# Altium schematic sheet Elkapod_power_supply_controller_module.SchDoc
size A2; SheetNumber: 1; SheetTotal: 6
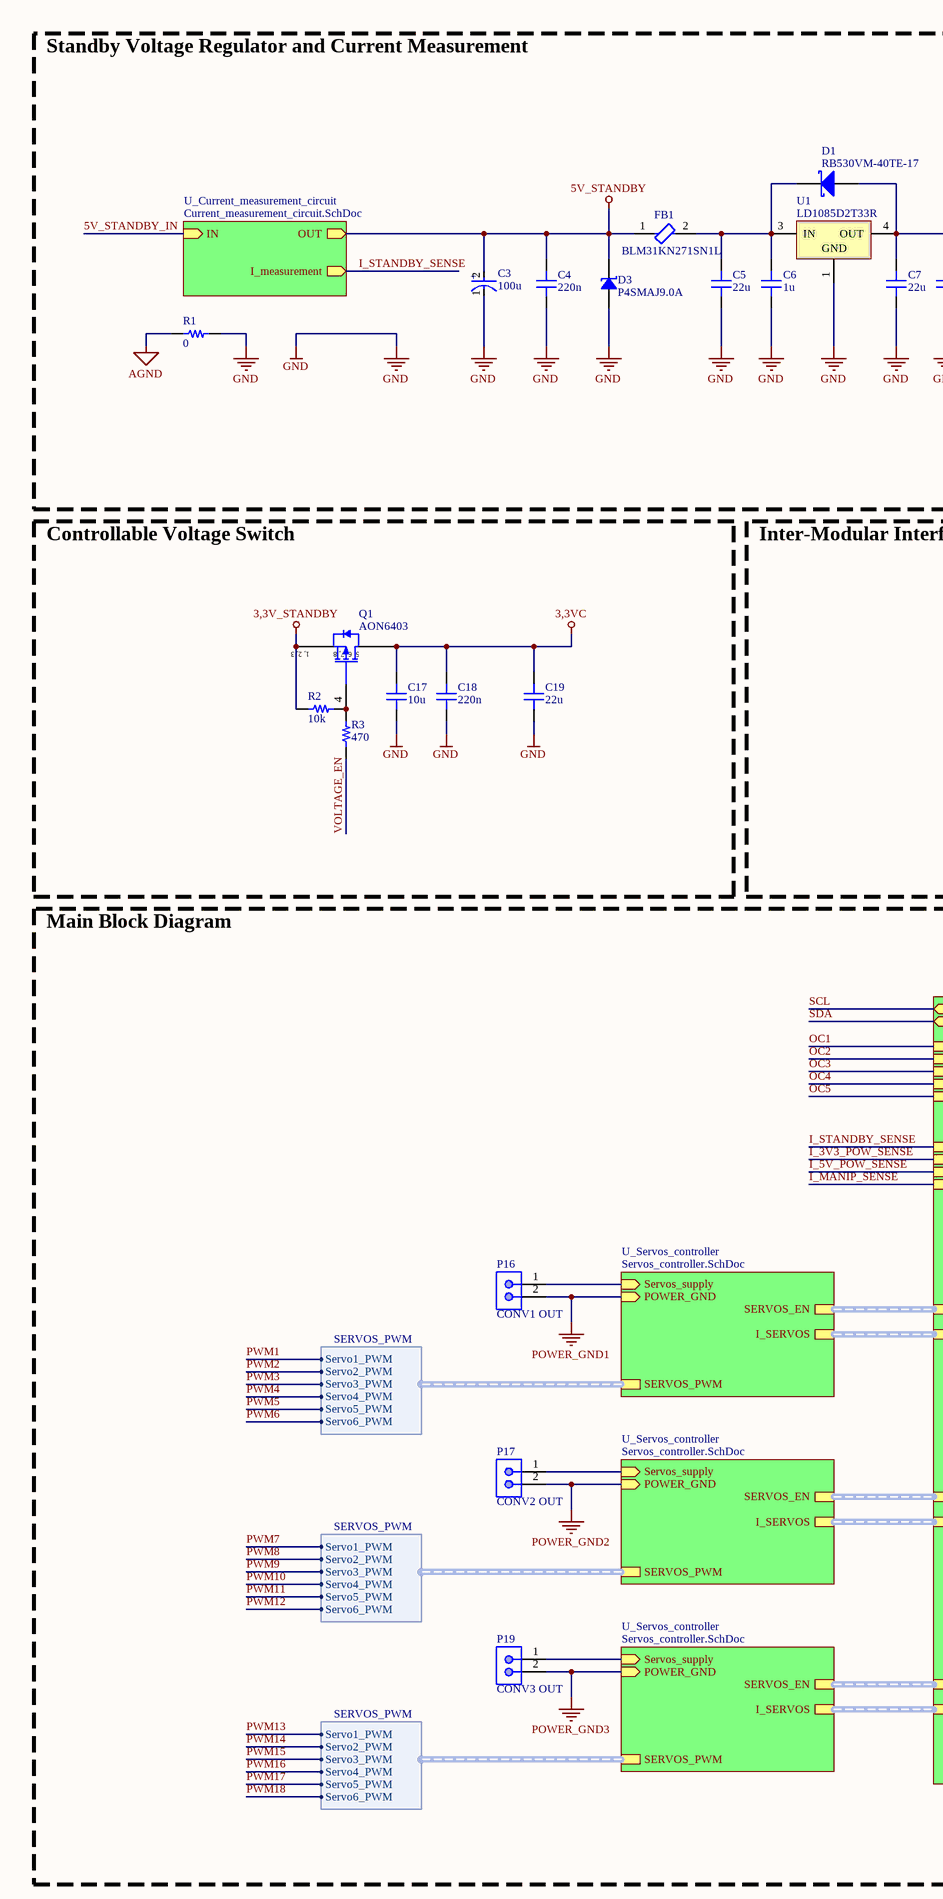
[diagram p0: Elkapod_power_supply_controller_module.SchDoc, left]
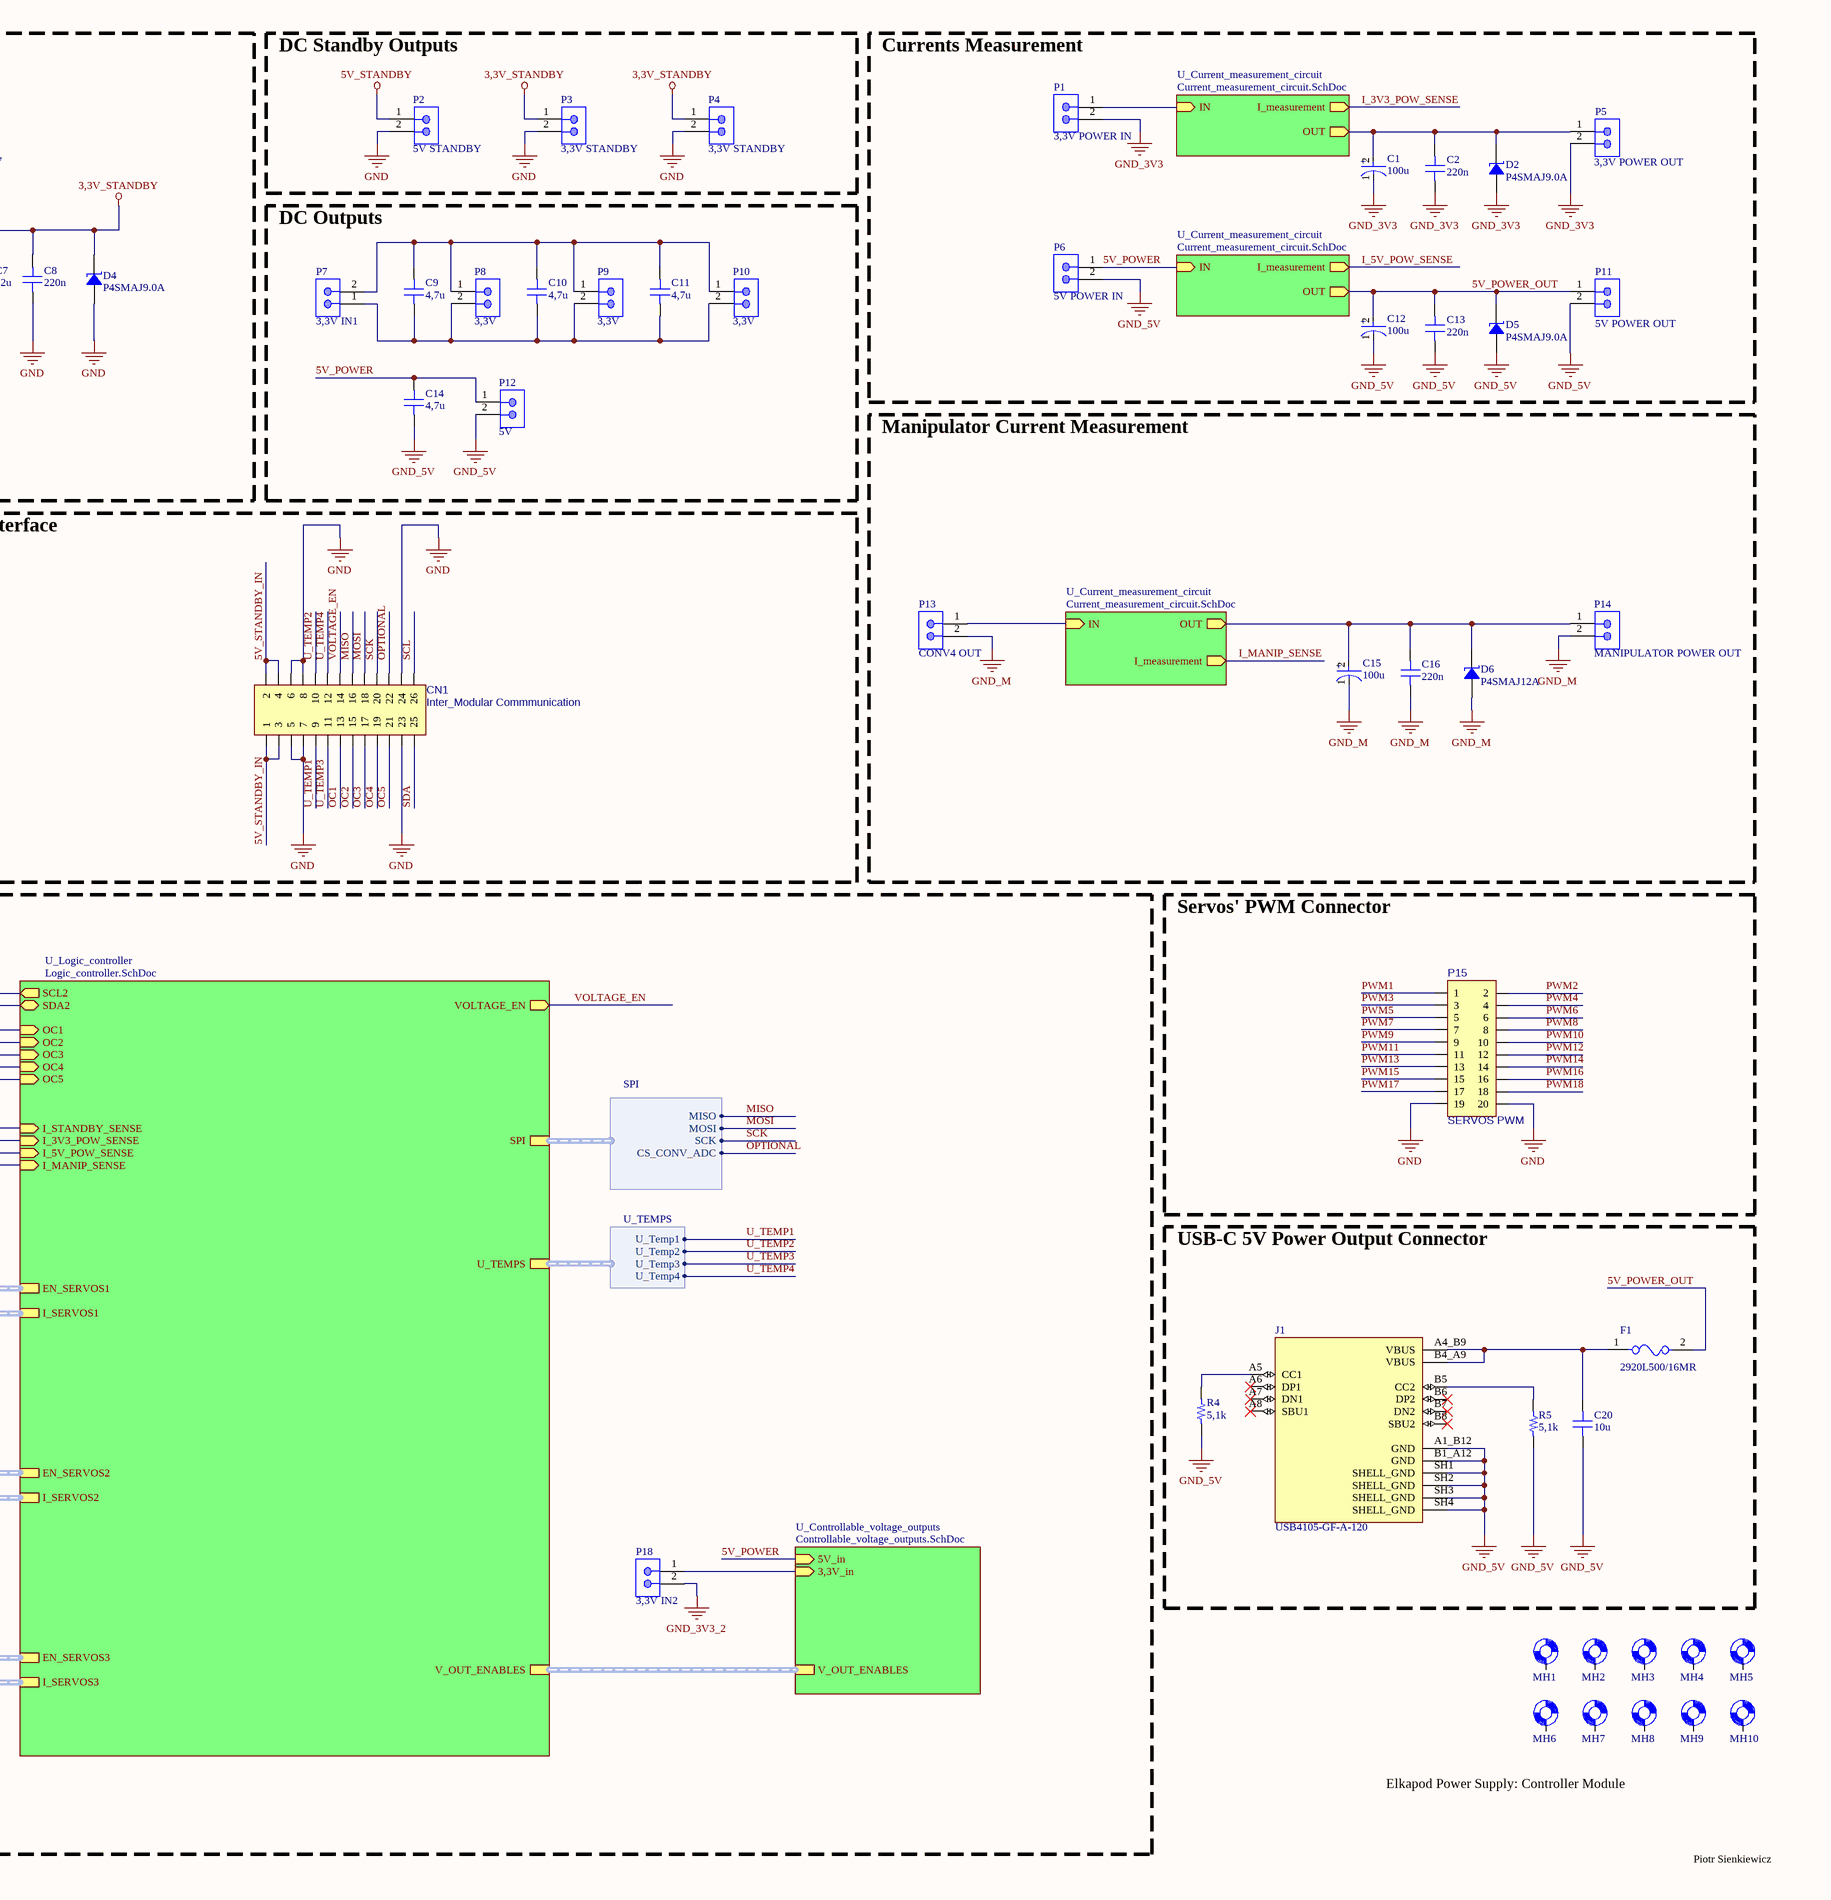
[diagram p1: Elkapod_power_supply_controller_module.SchDoc, right]

## Parts
C1  100u  [FP-FKE-MFG]
C2  220n  [CAP 0603_1608]
C3  100u  [FP-FKE-MFG]
C4  220n  [CAP 0603_1608]
C5  22u  [CAP 0805_2012]
C6  1u  [CAP 0603_1608]
C7  22u  [CAP 0805_2012]
C8  220n  [CAP 0603_1608]
C9  4,7u  [CAP 0603_1608]
C10  4,7u  [CAP 0603_1608]
C11  4,7u  [CAP 0603_1608]
C12  100u  [FP-FKE-MFG]
C13  220n  [CAP 0603_1608]
C14  4,7u  [CAP 0603_1608]
C15  100u  [FP-FKE-MFG]
C16  220n  [CAP 0603_1608]
C17  10u  [CAP 0603_1608]
C18  220n  [CAP 0603_1608]
C19  22u  [CAP 0805_2012]
C20  10u  [CAP 0603_1608]
CN1  Inter_Modular Commmunication  [GP_13x2]
D1  RB530VM-40TE-17  [SOD-323]
D2  P4SMAJ9.0A  [DO214AC SMA]
D3  P4SMAJ9.0A  [DO214AC SMA]
D4  P4SMAJ9.0A  [DO214AC SMA]
D5  P4SMAJ9.0A  [DO214AC SMA]
D6  P4SMAJ12A  [DO214AC SMA]
F1  2920L500/16MR  [FP-2920L-MFG]
FB1  BLM31KN271SN1L  [FP-BLM31-0_2-t1_6-d3_3-MFG]
J1  USB4105-GF-A-120  [USB4105-GF-A-120]
MH1  M3 Mounting Hole  [M3_MOUNTING_HOLE]  (value not drawn)
MH2  M3 Mounting Hole  [M3_MOUNTING_HOLE]  (value not drawn)
MH3  M3 Mounting Hole  [M3_MOUNTING_HOLE]  (value not drawn)
MH4  M3 Mounting Hole  [M3_MOUNTING_HOLE]  (value not drawn)
MH5  M3 Mounting Hole  [M3_MOUNTING_HOLE]  (value not drawn)
MH6  M3 Mounting Hole  [M3_MOUNTING_HOLE]  (value not drawn)
MH7  M3 Mounting Hole  [M3_MOUNTING_HOLE]  (value not drawn)
MH8  M3 Mounting Hole  [M3_MOUNTING_HOLE]  (value not drawn)
MH9  M3 Mounting Hole  [M3_MOUNTING_HOLE]  (value not drawn)
MH10  M3 Mounting Hole  [M3_MOUNTING_HOLE]  (value not drawn)
P1  3,3V POWER IN  [2x2,5mm2_WIRE]
P2  5V STANDBY  [MOLX-22-23-2021_V]
P3  3,3V STANDBY  [MOLX-22-23-2021_V]
P4  3,3V STANDBY  [MOLX-22-23-2021_V]
P5  3,3V POWER OUT  [XT60PW-M]
P6  5V POWER IN  [2x2,5mm2_WIRE]
P7  3,3V IN1  [2x2,5mm2_WIRE]
P8  3,3V  [MOLX-22-23-2021_V]
P9  3,3V  [MOLX-22-23-2021_V]
P10  3,3V  [MOLX-22-23-2021_V]
P11  5V POWER OUT  [XT60PW-M]
P12  5V  [MOLX-22-23-2021_V]
P13  CONV4 OUT  [2x2,5mm2_WIRE]
P14  MANIPULATOR POWER OUT  [XT60PW-M]
P15  SERVOS PWM  [IDC20]
P16  CONV1 OUT  [2x2,5mm2_WIRE]
P17  CONV2 OUT  [2x2,5mm2_WIRE]
P18  3,3V IN2  [2x2,5mm2_WIRE]
P19  CONV3 OUT  [2x2,5mm2_WIRE]
Q1  AON6403  [DFN5x6]
R1  0  [RES 0603_1608]
R2  10k  [RES 0603_1608]
R3  470  [RES 0603_1608]
R4  5,1k  [RES 0603_1608]
R5  5,1k  [RES 0603_1608]
U1  LD1085D2T33R  [TO-263_M]

## Blocks framed on the sheet
Standby Voltage Regulator and Current Measurement: C3-C8 D1 D3 D4 FB1 R1 U1
DC Standby Outputs: P2-P4
Currents Measurement: C1 C2 C12 C13 D2 D5 P1 P5 P6 P11
DC Outputs: C9-C11 C14 P7-P10 P12
Manipulator Current Measurement: C15 C16 D6 P13 P14
Controllable Voltage Switch: C17-C19 Q1 R2 R3
Inter-Modular Interface: CN1
Main Block Diagram: P16-P19
Servos' PWM Connector: P15
USB-C 5V Power Output Connector: C20 F1 J1 R4 R5

## Sub-sheets
U_Controllable_voltage_outputs = Controllable_voltage_outputs.SchDoc: 5V_in (in), 3,3V_in (in), V_OUT_ENABLES (harness V_OUT_ENABLES)
U_Current_measurement_circuit = Current_measurement_circuit.SchDoc: I_measurement (out), IN (in), OUT (out)  | Rsense_value: 1m; C_value: 47u
U_Current_measurement_circuit = Current_measurement_circuit.SchDoc: I_measurement (out), IN (in), OUT (out)  | Rsense_value: 8m; C_value: 47u
U_Current_measurement_circuit = Current_measurement_circuit.SchDoc: I_measurement (out), IN (in), OUT (out)  | Rsense_value: 2m; C_value: 47u
U_Current_measurement_circuit = Current_measurement_circuit.SchDoc: I_measurement (out), IN (in), OUT (out)  | Rsense_value: 8m
U_Logic_controller = Logic_controller.SchDoc: OC1 (in), OC2 (in), OC3 (in), OC4 (in), OC5 (in), I_STANDBY_SENSE (in), I_3V3_POW_SENSE (in), I_5V_POW_SENSE (in), I_MANIP_SENSE (in), VOLTAGE_EN (out), SCL2 (out), SDA2 (bidir), V_OUT_ENABLES (harness V_OUT_ENABLES), SPI (harness SPI), I_SERVOS1 (harness I_SERVOS), I_SERVOS2 (harness I_SERVOS), I_SERVOS3 (harness I_SERVOS), EN_SERVOS1 (harness EN_SERVOS), EN_SERVOS2 (harness EN_SERVOS), EN_SERVOS3 (harness EN_SERVOS), U_TEMPS (harness U_TEMPS)
U_Servos_controller = Servos_controller.SchDoc: Servos_supply (in), I_SERVOS (harness I_SERVOS), SERVOS_EN (harness EN_SERVOS), SERVOS_PWM (harness SERVOS_PWM), POWER_GND (in)
U_Servos_controller = Servos_controller.SchDoc: Servos_supply (in), I_SERVOS (harness I_SERVOS), SERVOS_EN (harness EN_SERVOS), SERVOS_PWM (harness SERVOS_PWM), POWER_GND (in)
U_Servos_controller = Servos_controller.SchDoc: Servos_supply (in), I_SERVOS (harness I_SERVOS), SERVOS_EN (harness EN_SERVOS), SERVOS_PWM (harness SERVOS_PWM), POWER_GND (in)

## Harnesses
SPI: MISO, MOSI, SCK, CS_CONV_ADC
U_TEMPS: U_Temp1, U_Temp2, U_Temp3, U_Temp4
SERVOS_PWM: Servo1_PWM, Servo2_PWM, Servo3_PWM, Servo4_PWM, Servo5_PWM, Servo6_PWM

## Nets
3,3V_STANDBY: C7.2 C8.2 D1.2(A) D4.2 P3.1 P4.1 Q1.1(S) Q1.2(S) Q1.3(S) R2.1 U1.4(OUT)
3,3VC: C17.2 C18.2 C19.2 Q1.5(D)
5V_STANDBY: C3.2(A) C4.1 D3.2 FB1.1 P2.1 ; sheet U_Current_measurement_circuit/OUT
AGND: R1.1
GND: C3.1(C) C4.2 C5.1 C6.1 C7.1 C8.1 C17.1 C18.1 C19.1 CN1.5 CN1.6 CN1.7 CN1.8 CN1.23 CN1.24 D3.1 D4.1 P2.2 P3.2 P4.2 P15.19 P15.20 R1.2 U1.1(GND)
GND_3V3: C1.1(C) C2.2 D2.1 P1.2(-) P5.2(-)
GND_3V3_2: P18.2(-)
GND_5V: C12.1(C) C13.2 C14.1 C20.1 D5.1 J1.A1_B12(GND) J1.B1_A12(GND) J1.SH1(SHELL_GND) J1.SH2(SHELL_GND) J1.SH3(SHELL_GND) J1.SH4(SHELL_GND) P6.2(-) P11.2(-) P12.2 R4.2 R5.2
GND_M: C15.1(C) C16.2 D6.1 P13.2(-) P14.2(-)
POWER_GND1: P16.2(-) ; sheet U_Servos_controller/POWER_GND
POWER_GND2: P17.2(-) ; sheet U_Servos_controller/POWER_GND
POWER_GND3: P19.2(-) ; sheet U_Servos_controller/POWER_GND
5V_POWER: C14.2 P6.1(+) P12.1 ; sheet U_Current_measurement_circuit/IN, sheet U_Controllable_voltage_outputs/5V_in
5V_POWER_OUT: C12.2(A) C13.1 D5.2 F1.2 P11.1(+) ; sheet U_Current_measurement_circuit/OUT
5V_STANDBY_IN: CN1.1 CN1.2 CN1.3 CN1.4 ; sheet U_Current_measurement_circuit/IN
I_3V3_POW_SENSE: sheet U_Current_measurement_circuit/I_measurement, sheet U_Logic_controller/I_3V3_POW_SENSE
I_5V_POW_SENSE: sheet U_Current_measurement_circuit/I_measurement, sheet U_Logic_controller/I_5V_POW_SENSE
I_MANIP_SENSE: sheet U_Current_measurement_circuit/I_measurement, sheet U_Logic_controller/I_MANIP_SENSE
I_STANDBY_SENSE: sheet U_Current_measurement_circuit/I_measurement, sheet U_Logic_controller/I_STANDBY_SENSE
MISO: CN1.16 ; sheet U_Logic_controller/SPI.MISO
MOSI: CN1.18 ; sheet U_Logic_controller/SPI.MOSI
OC1: CN1.13 ; sheet U_Logic_controller/OC1
OC2: CN1.15 ; sheet U_Logic_controller/OC2
OC3: CN1.17 ; sheet U_Logic_controller/OC3
OC4: CN1.19 ; sheet U_Logic_controller/OC4
OC5: CN1.21 ; sheet U_Logic_controller/OC5
OPTIONAL: CN1.22 ; sheet U_Logic_controller/SPI.CS_CONV_ADC
PWM1: P15.1 ; sheet U_Servos_controller/SERVOS_PWM.Servo1_PWM
PWM2: P15.2 ; sheet U_Servos_controller/SERVOS_PWM.Servo2_PWM
PWM3: P15.3 ; sheet U_Servos_controller/SERVOS_PWM.Servo3_PWM
PWM4: P15.4 ; sheet U_Servos_controller/SERVOS_PWM.Servo4_PWM
PWM5: P15.5 ; sheet U_Servos_controller/SERVOS_PWM.Servo5_PWM
PWM6: P15.6 ; sheet U_Servos_controller/SERVOS_PWM.Servo6_PWM
PWM7: P15.7 ; sheet U_Servos_controller/SERVOS_PWM.Servo1_PWM
PWM8: P15.8 ; sheet U_Servos_controller/SERVOS_PWM.Servo2_PWM
PWM9: P15.9 ; sheet U_Servos_controller/SERVOS_PWM.Servo3_PWM
PWM10: P15.10 ; sheet U_Servos_controller/SERVOS_PWM.Servo4_PWM
PWM11: P15.11 ; sheet U_Servos_controller/SERVOS_PWM.Servo5_PWM
PWM12: P15.12 ; sheet U_Servos_controller/SERVOS_PWM.Servo6_PWM
PWM13: P15.13 ; sheet U_Servos_controller/SERVOS_PWM.Servo1_PWM
PWM14: P15.14 ; sheet U_Servos_controller/SERVOS_PWM.Servo2_PWM
PWM15: P15.15 ; sheet U_Servos_controller/SERVOS_PWM.Servo3_PWM
PWM16: P15.16 ; sheet U_Servos_controller/SERVOS_PWM.Servo4_PWM
PWM17: P15.17 ; sheet U_Servos_controller/SERVOS_PWM.Servo5_PWM
PWM18: P15.18 ; sheet U_Servos_controller/SERVOS_PWM.Servo6_PWM
SCK: CN1.20 ; sheet U_Logic_controller/SPI.SCK
SCL: CN1.26 ; sheet U_Logic_controller/SCL2
SDA: CN1.25 ; sheet U_Logic_controller/SDA2
U_TEMP1: CN1.9 ; sheet U_Logic_controller/U_TEMPS.U_Temp1
U_TEMP2: CN1.10 ; sheet U_Logic_controller/U_TEMPS.U_Temp2
U_TEMP3: CN1.11 ; sheet U_Logic_controller/U_TEMPS.U_Temp3
U_TEMP4: CN1.12 ; sheet U_Logic_controller/U_TEMPS.U_Temp4
VOLTAGE_EN: CN1.14 R3.2 ; sheet U_Logic_controller/VOLTAGE_EN
NetC1_2: C1.2(A) C2.1 D2.2 P5.1(+) ; sheet U_Current_measurement_circuit/OUT
NetC5_2: C5.2 C6.2 D1.1(K) FB1.2 U1.3(IN)
NetC9_1: C9.1 C10.1 C11.1 P7.1(+) P8.2 P9.2 P10.2
NetC9_2: C9.2 C10.2 C11.2 P7.2(-) P8.1 P9.1 P10.1
NetC15_2: C15.2(A) C16.1 D6.2 P14.1(+) ; sheet U_Current_measurement_circuit/OUT
NetC20_2: C20.2 F1.1 J1.A4_B9(VBUS) J1.B4_A9(VBUS)
NetJ1_A5: J1.A5(CC1) R4.1
NetJ1_B5: J1.B5(CC2) R5.1
NetP1_1: P1.1(+) ; sheet U_Current_measurement_circuit/IN
NetP13_1: P13.1(+) ; sheet U_Current_measurement_circuit/IN
NetP16_1: P16.1(+) ; sheet U_Servos_controller/Servos_supply
NetP17_1: P17.1(+) ; sheet U_Servos_controller/Servos_supply
NetP18_1: P18.1(+) ; sheet U_Controllable_voltage_outputs/3,3V_in
NetP19_1: P19.1(+) ; sheet U_Servos_controller/Servos_supply
NetQ1_4: Q1.4(G) R2.2 R3.1

Not connected (* = marked no-connect by the designer): J1 A6(DP1)* A7(DN1)* A8(SBU1)* B6(DP2)* B7(DN2)* B8(SBU2)*; MH1 1; MH2 1; MH3 1; MH4 1; MH5 1; MH6 1; MH7 1; MH8 1; MH9 1; MH10 1

## Buses and harness runs
harness sheet U_Controllable_voltage_outputs/V_OUT_ENABLES = sheet U_Logic_controller/V_OUT_ENABLES
harness sheet U_Logic_controller/EN_SERVOS1 = sheet U_Servos_controller/SERVOS_EN
harness sheet U_Logic_controller/EN_SERVOS2 = sheet U_Servos_controller/SERVOS_EN
harness sheet U_Logic_controller/EN_SERVOS3 = sheet U_Servos_controller/SERVOS_EN
harness sheet U_Logic_controller/I_SERVOS1 = sheet U_Servos_controller/I_SERVOS
harness sheet U_Logic_controller/I_SERVOS2 = sheet U_Servos_controller/I_SERVOS
harness sheet U_Logic_controller/I_SERVOS3 = sheet U_Servos_controller/I_SERVOS

## Notes on the sheet
- Elkapod Power Supply: Controller Module
- Piotr Sienkiewicz
- (in symbol AON6403) 1, 2, 3; 5, 6, 7, 8
- (in symbol CMP-2000-06205-2) +

## Library data of the parts
C1 C3 C12 C15 = CMP-2000-06205-2: CAP ALUM 100UF 20% 25V SMD; Ripple Current (AC): 300mA; Leakage Current: 3uA; Dielectric Material: Aluminium; Impedance: 260mR; Life (Hours): 2000Hour; Max Operating Temperature: 105°C; Voltage Rating (DC): 25V; Packaging: Tape and Reel; Min Operating Temperature: -55°C; Capacitance: 100uF; Ripple Current: 300mA; Mount: Surface Mount; Lead Free: Lead Free; Construction: Cylindrical; Voltage Rating: 25V; RoHS Compliant: Yes; Case/Package: Radial; Height: 6.2mm; Tolerance: 20%; Diameter: 8mm; Termination: SMD/SMT; Package Quantity: 1; Width: 8.3mm; REACH SVHC: No SVHC; Series: FK; Number of Pins: 2; Voltage: 25V; Radiation Hardening: No; Height - Seated (Max): 0.244inch; Length: 6.2mm; ESR (Equivalent Series Resistance): 260mR
C2 C4 C8 C13 C16 C18 = C0603C272F3GAC7867: CAP CER 220nF 25V X5R 0603; manufacturer: KEMET; Temperature Coefficient: C0G, NP0; Tolerance: ±1%; Part Number: C0603C272F3GAC7867; Value: 220n; Applications: General Purpose; Capacitance: 220n; componentlink1description: Datasheet; componentlink1url: https://api.kemet.com/component-edge/download/datasheet/C0603C272F3GACTU.pdf; componentlink2description: DigiKey Link; componentlink2url: https://www.digikey.com/en/products/detail/kemet/C0603C272F3GAC7867/2200413; Device Package: 0603 (1608 Metric); Features: Low ESL; lastupdated: 09.02.2024 20:10:30; Lifecycle Status: Active; Minimum Order: 1; Mounting Type: Surface Mount, MLCC; Operating Temperature: -55°C ~ 125°C; Package / Case: 0603 (1608 Metric); packaging: TapeAndReel; partid: 2138; Part Status: Active; price: 0.40; series: SMD Comm C0G; Size / Dimension: 0.063" L x 0.031" W (1.60mm x 0.80mm); Thickness (Max): 0.034" (0.87mm); Voltage - Rated: 25V
C5 C7 C19 = VJ0805Y684KXQTW1BC: CAP CER 22UF 25V X7R 0805; manufacturer: Vishay Vitramon; Tolerance: ±10%; Voltage - Rated: 10V; Part Number: VJ0805Y684KXQTW1BC; Value: 22u; Applications: General Purpose; Capacitance: 22u; componentlink1description: Datasheet; componentlink1url: https://www.vishay.com/docs/28548/vjw1bcbascomseries.pdf; componentlink2description: DigiKey Link; componentlink2url: https://www.digikey.com/en/products/detail/vishay-vitramon/VJ0805Y684KXQTW1BC/8313569; Device Package: 0805 (2012 Metric); lastupdated: 09.02.2024 20:13:13; Lifecycle Status: Active; Minimum Order: 1; Mounting Type: Surface Mount, MLCC; Operating Temperature: -55°C ~ 125°C; Package / Case: 0805 (2012 Metric); packaging: TapeAndReel; partid: 57262; price: 0.05; series: VJ W1BC; Size / Dimension: 0.079" L x 0.049" W (2.00mm x 1.25mm); Temperature Coefficient: X7R; Thickness (Max): 0.053" (1.35mm)
C6 = C0603C272F3GAC7867: CAP CER 1uF 16V X5R 0603; manufacturer: KEMET; Temperature Coefficient: C0G, NP0; Tolerance: ±1%; Voltage - Rated: 25V; Part Number: C0603C272F3GAC7867; Value: 1u; Applications: General Purpose; Capacitance: 1u; componentlink1description: Datasheet; componentlink1url: https://api.kemet.com/component-edge/download/datasheet/C0603C272F3GACTU.pdf; componentlink2description: DigiKey Link; componentlink2url: https://www.digikey.com/en/products/detail/kemet/C0603C272F3GAC7867/2200413; Device Package: 0603 (1608 Metric); Features: Low ESL; lastupdated: 09.02.2024 20:10:30; Lifecycle Status: Active; Minimum Order: 1; Mounting Type: Surface Mount, MLCC; Operating Temperature: -55°C ~ 125°C; Package / Case: 0603 (1608 Metric); packaging: TapeAndReel; partid: 2138; Part Status: Active; price: 0.40; series: SMD Comm C0G; Size / Dimension: 0.063" L x 0.031" W (1.60mm x 0.80mm); Thickness (Max): 0.034" (0.87mm)
C9-C11 C14 = C0603C272F3GAC7867: CAP CER 4,7uF 25V X5R 0603; manufacturer: KEMET; Temperature Coefficient: C0G, NP0; Tolerance: ±1%; Part Number: C0603C272F3GAC7867; Value: 4,7u; Applications: General Purpose; Capacitance: 4,7u; componentlink1description: Datasheet; componentlink1url: https://api.kemet.com/component-edge/download/datasheet/C0603C272F3GACTU.pdf; componentlink2description: DigiKey Link; componentlink2url: https://www.digikey.com/en/products/detail/kemet/C0603C272F3GAC7867/2200413; Device Package: 0603 (1608 Metric); Features: Low ESL; lastupdated: 09.02.2024 20:10:30; Lifecycle Status: Active; Minimum Order: 1; Mounting Type: Surface Mount, MLCC; Operating Temperature: -55°C ~ 125°C; Package / Case: 0603 (1608 Metric); packaging: TapeAndReel; partid: 2138; Part Status: Active; price: 0.40; series: SMD Comm C0G; Size / Dimension: 0.063" L x 0.031" W (1.60mm x 0.80mm); Thickness (Max): 0.034" (0.87mm); Voltage - Rated: 25V
C17 C20 = C0603C272F3GAC7867: CAP CER 10uF 35V X5R 0603; manufacturer: KEMET; Temperature Coefficient: C0G, NP0; Tolerance: ±1%; Voltage - Rated: 25V; Part Number: C0603C272F3GAC7867; Value: 10u; Applications: General Purpose; Capacitance: 10u; componentlink1description: Datasheet; componentlink1url: https://api.kemet.com/component-edge/download/datasheet/C0603C272F3GACTU.pdf; componentlink2description: DigiKey Link; componentlink2url: https://www.digikey.com/en/products/detail/kemet/C0603C272F3GAC7867/2200413; Device Package: 0603 (1608 Metric); Features: Low ESL; lastupdated: 09.02.2024 20:10:30; Lifecycle Status: Active; Minimum Order: 1; Mounting Type: Surface Mount, MLCC; Operating Temperature: -55°C ~ 125°C; Package / Case: 0603 (1608 Metric); packaging: TapeAndReel; partid: 2138; Part Status: Active; price: 0.40; series: SMD Comm C0G; Size / Dimension: 0.063" L x 0.031" W (1.60mm x 0.80mm); Thickness (Max): 0.034" (0.87mm)
CN1 = CN_13x2
D1 = BAS140W: Schottky diode; 0,1A; 40V; Published: 21-Mar-2003; LatestRevisionDate: 19-Mar-2004; LatestRevisionNote: Silkscreen size reduced.; DatasheetDocument: Oct-1999; PackageDocument: Sep-2000; PackageReference: SOD-323; Publisher: Altium Limited; ComponentLink1Description: Manufacturer Link; ComponentLink1URL: http://www.infineon.com/; ComponentLink2Description: Datasheet; ComponentLink2URL: http://www.infineon.com/upload/Document/cmc_upload/documents/009/386/bas70_bas170series_1.pdf
D2-D5 = SMA6J18A-TP: TVS DIODE 9VDC DO214AC; Part Number: P4SMAJ9.0A
D6 = SMA6J18A-TP: TVS DIODE 12VDC DO214AC; Part Number: P4SMAJ9.0A
F1 = CMP-08606-000017-1: PTC RESET FUSE 16V 5A 2920; Manufacturer: Littelfuse; Trip Time: 5s; Value: 0.005-0.025Ω; Trip Current: 10A; Current Rating: 40A; Category: Fuse; ComponentLink2URL: https://www.littelfuse.com/~/media/electronics/datasheets/resettable_ptcs/littelfuse_ptc_2920l_datasheet.pdf.pdf; Voltage Rating: 16V; RoHS: TRUE; Manufacturer Part Number: 2920L500/16MR; Ambient Temperature Range High: +85°C; Ambient Temperature Range Low: -40°C; Temperature Range Low: -40°C; Automotive: No; Octopart: https://octopart.com/2920l500%2F16mr-littelfuse-28867177; Resistance: 0.005-0.025Ω; Package: 2920L; Height: 1.6mm; Lead Free: Yes; Device Class L1: Circuit Protection; Temperature: -40°C to +85°C; Mouser Description: PTC Resettable Fuse 5A(hold) 10A(trip) 16VDC 40A 2W 5s 0.005Ohm SMD Solder Pad 7.98 X 5.44 X 1.6mm T/R; Device Class L3: unset; Digikey Description: PTC RESET FUSE 16V 5A 2920; Device Class L2: PTC Resettable Fuses; ComponentLink2Description: Datasheet; Hold Current: 5A; Temperature Range High: +85°C
FB1 = CMP-06046-002074-1: Chip Ferrite Bead, 1206, 270Ω @ 100MHz, 0.016Ω, 25%, 4.5A; DC Resistance (DCR): 16mR; Number of Lines: 1; Mount: Surface Mount; Case Code (Imperial): 1206; Case/Package: 1206; Packaging: Cut Tape; Min Operating Temperature: -55°C; Max Current Rating: 4.5A; Case Code (Metric): 3216; Max Operating Temperature: 125°C
J1 = USB4105-GF-A-120: USB C socket; SMT; PIN: 16; top board mount; 5A
P1 P6 P7 P13 P16-P19 = 2X2,5mm2_WIRE: 2x2,5mm2 wire pads
P2-P4 P8-P10 P12 = CMP-1704-00001-3: Male Header, Pitch 2.54 mm, 1 x 2 Position, Height 10.67 mm, Tail Length 3.56 mm, 0 to 75 degC, RoHS, Bulk; Package Quantity: 3000; Height: 10.67 mm; RoHSCompliant: True; ComponentLink2URL: https://datasheet.ciiva.com/19454/232266-19454304.pdf; PartNumber: 22-23-2021; Packaging: Bulk; ComponentLink2Description: Datasheet; Min Operating Temperature: 0 degC; ComponentLink1Description: Manufacturer URL; Length: 5.08 mm; Mounting Technology: Through Hole; Max Operating Temperature: 75 degC; REACH SVHC: Unknown; PackageDescription: Male Header, Pitch 2.54 mm, 1 x 2 Position, Height 10.67 mm, Tail Length 3.56 mm; ComponentLink1URL: http://www.molex.com/; Mount: Through Hole; Radiation Hardening: No; Width: 6.35 mm; Pins: 2
P5 P11 P14 = XT60PW-M: XT60PW-M; 30A/500V angled female DC PCB socket (pin1 -> +, pin2 -> -)
P15 = CN_10x2
Q1 = AON6403: P-MOSFET; 67A; 30V; DFN5x6
R1 = RNCS0603BKE10K0: RES 0 OHM 1% 0,1W 0603; Manufacturer: Stackpole Electronics Inc; Power (Watts): 0.063W, 1/16W; Temperature Coefficient: ±25ppm/°C; Tolerance: ±0.1%; Part Number: RNCS0603BKE10K0; Value: 0; Composition: Thin Film; Device Package: 0603 (1608 Metric); Features: Anti-Corrosive, Automotive AEC-Q200, Moisture Resistant; Height - Seated (Max): 0.022" (0.55mm); LastUpdated: 09.02.2024 20:43:37; Lifecycle Status: Active; Minimum Order: 1; Number of Terminations: 2; Operating Temperature: -55°C ~ 155°C; Package / Case: 0603 (1608 Metric); Packaging: TapeAndReel; PartId: 4838; Part Status: Active; Price: 0.06; Ratings: AEC-Q200; Resistance: 0; Series: RNCS; Size / Dimension: 0.061" L x 0.031" W (1.55mm x 0.80mm); Supplier Device Package: 0603
R2 = RNCS0603BKE10K0: RES 10K OHM 1% 0,1W 0603; Manufacturer: Stackpole Electronics Inc; Power (Watts): 0.063W, 1/16W; Temperature Coefficient: ±25ppm/°C; Tolerance: ±0.1%; Part Number: RNCS0603BKE10K0; Value: 10k; Composition: Thin Film; Device Package: 0603 (1608 Metric); Features: Anti-Corrosive, Automotive AEC-Q200, Moisture Resistant; Height - Seated (Max): 0.022" (0.55mm); LastUpdated: 09.02.2024 20:43:37; Lifecycle Status: Active; Minimum Order: 1; Number of Terminations: 2; Operating Temperature: -55°C ~ 155°C; Package / Case: 0603 (1608 Metric); Packaging: TapeAndReel; PartId: 4838; Part Status: Active; Price: 0.06; Ratings: AEC-Q200; Resistance: 10k; Series: RNCS; Size / Dimension: 0.061" L x 0.031" W (1.55mm x 0.80mm); Supplier Device Package: 0603
R3 = RNCS0603BKE10K0: RES 470 OHM 1% 0,1W 0603; Manufacturer: Stackpole Electronics Inc; Power (Watts): 0.063W, 1/16W; Temperature Coefficient: ±25ppm/°C; Tolerance: ±0.1%; Part Number: RNCS0603BKE10K0; Value: 470; Composition: Thin Film; Device Package: 0603 (1608 Metric); Features: Anti-Corrosive, Automotive AEC-Q200, Moisture Resistant; Height - Seated (Max): 0.022" (0.55mm); LastUpdated: 09.02.2024 20:43:37; Lifecycle Status: Active; Minimum Order: 1; Number of Terminations: 2; Operating Temperature: -55°C ~ 155°C; Package / Case: 0603 (1608 Metric); Packaging: TapeAndReel; PartId: 4838; Part Status: Active; Price: 0.06; Ratings: AEC-Q200; Resistance: 470; Series: RNCS; Size / Dimension: 0.061" L x 0.031" W (1.55mm x 0.80mm); Supplier Device Package: 0603
R4 R5 = RNCS0603BKE10K0: RES 5,1K OHM 1% 0,1W 0603; Manufacturer: Stackpole Electronics Inc; Power (Watts): 0.063W, 1/16W; Temperature Coefficient: ±25ppm/°C; Tolerance: ±0.1%; Part Number: RNCS0603BKE10K0; Value: 5,1k; Composition: Thin Film; Device Package: 0603 (1608 Metric); Features: Anti-Corrosive, Automotive AEC-Q200, Moisture Resistant; Height - Seated (Max): 0.022" (0.55mm); LastUpdated: 09.02.2024 20:43:37; Lifecycle Status: Active; Minimum Order: 1; Number of Terminations: 2; Operating Temperature: -55°C ~ 155°C; Package / Case: 0603 (1608 Metric); Packaging: TapeAndReel; PartId: 4838; Part Status: Active; Price: 0.06; Ratings: AEC-Q200; Resistance: 5,1k; Series: RNCS; Size / Dimension: 0.061" L x 0.031" W (1.55mm x 0.80mm); Supplier Device Package: 0603
U1 = CMP-0244-00169-1: 3A, Low Drop Positive Voltage Regulator, 3.3V, 3-Pin D2PAK; ComponentLink1URL: http://www.st.com; PackageVersion: 2011; ComponentLink1Description: Manufacturer URL; ComponentLink2URL: http://www.st.com/internet/com/TECHNICAL_RESOURCES/TECHNICAL_LITERATURE/DATASHEET/CD00001883.pdf; PackageDescription: 3-Pin Transistor Outline Package 2.54 mm Pitch, 15.4 mm Lead Span (D2PAK); DatasheetVersion: 28/07/2009; ComponentLink2Description: Datasheet; PackageReference: TO-263